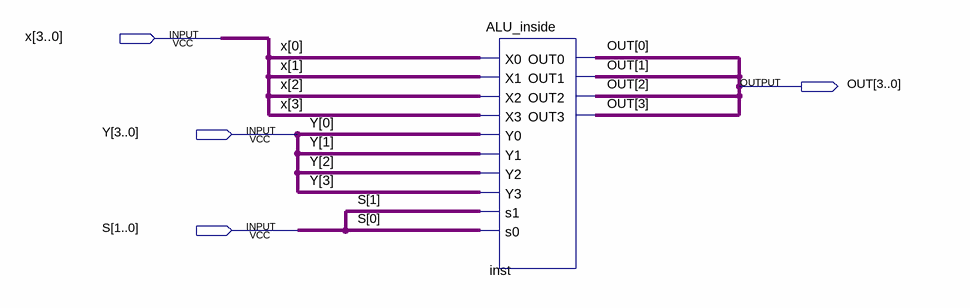
[diagram p0: schematic sheet]
// Quartus schematic ALU.bdf as structural Verilog: 1 symbols, 4 pins
module ALU (
  input  [3:0] x,
  input  [3:0] Y,
  input  [1:0] S,
  output [3:0] OUT
);

  ALU_inside inst (
    .X0(x[0]), .X1(x[1]), .X2(x[2]), .X3(x[3]), .Y0(Y[0]), .Y1(Y[1]), .Y2(Y[2]), .Y3(Y[3]), .s1(S[1]),
    .s0(S[0]), .OUT0(OUT[0]), .OUT1(OUT[1]), .OUT2(OUT[2]), .OUT3(OUT[3]));
endmodule
